# EAGLE schematic morse_lora (EAGLE 9.6.2)
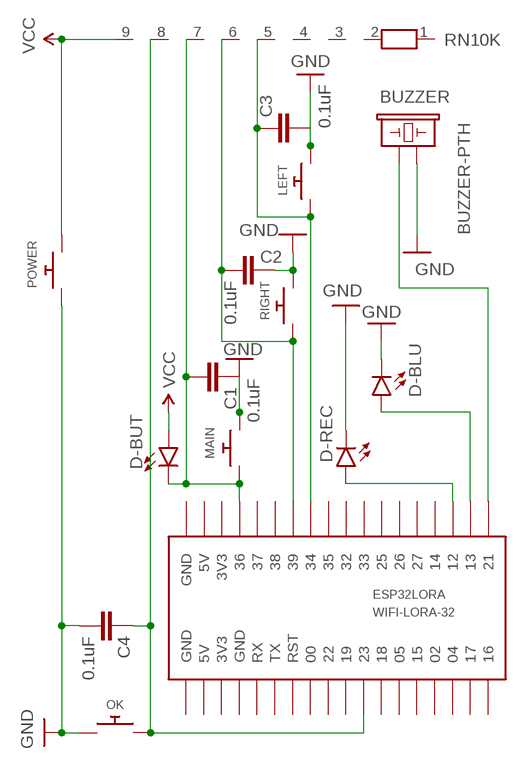
[diagram p0: schematic, sheet 1]

## Parts
BUZZER  BUZZER-PTH  [BUZZER-12MM]
C1  0.1uF  0.1UF-KIT-EZ-50V-20%  [CAP-PTH-SMALL-KIT]
C2  0.1uF  0.1UF-KIT-EZ-50V-20%  [CAP-PTH-SMALL-KIT]
C3  0.1uF  0.1UF-KIT-EZ-50V-20%  [CAP-PTH-SMALL-KIT]
C4  0.1uF  0.1UF-KIT-EZ-50V-20%  [CAP-PTH-SMALL-KIT]
D-BLU  LED5MM  [LED_5MM]
D-BUT  LED5MM  [LED_5MM]
D-REC  LED5MM  [LED_5MM]
ESP32LORA  WIFI-LORA-32  [2.54MM_2X18]
LEFT  SWITCH_PUSHBUTTONEVQ-PE  [TACT_PANA-EVQ]
MAIN  SWITCH_PUSHBUTTONEVQ-PE  [TACT_PANA-EVQ]
OK  SWITCH_PUSHBUTTONEVQ-PE  [TACT_PANA-EVQ]
POWER  SWITCH_PUSHBUTTONEVQ-PE  [TACT_PANA-EVQ]
RIGHT  SWITCH_PUSHBUTTONEVQ-PE  [TACT_PANA-EVQ]
RN10K  RN08  [RN-9]

## Nets
GND: BUZZER.- C1.1 C2.1 C3.2 C4.2 D-BLU.K(C) D-REC.K(C) LEFT.P$2 MAIN.P$2 OK.P$1 POWER.P$1 RIGHT.P$2
N$1: C1.2 D-BUT.K(C) ESP32LORA.P$33 MAIN.P$1 RN10K.7
N$2: C2.2 ESP32LORA.P$30 RIGHT.P$1 RN10K.6
N$3: C3.1 ESP32LORA.P$29 LEFT.P$1 RN10K.5
N$4: BUZZER.+ ESP32LORA.P$19
N$5: D-REC.A ESP32LORA.P$21
N$6: D-BLU.A ESP32LORA.P$20
N$7: C4.1 ESP32LORA.P$11 OK.P$2 RN10K.8
VCC: D-BUT.A POWER.P$2 RN10K.9
Unconnected: ESP32LORA.P$1(GND) ESP32LORA.P$2(5V) ESP32LORA.P$3(3V3) ESP32LORA.P$4(GND) ESP32LORA.P$5(RX) ESP32LORA.P$6(TX) ESP32LORA.P$7(RST) ESP32LORA.P$8 ESP32LORA.P$9 ESP32LORA.P$10 ESP32LORA.P$12 ESP32LORA.P$13 ESP32LORA.P$14 ESP32LORA.P$15 ESP32LORA.P$16 ESP32LORA.P$17 ESP32LORA.P$18 ESP32LORA.P$22 ESP32LORA.P$23 ESP32LORA.P$24 ESP32LORA.P$25 ESP32LORA.P$26 ESP32LORA.P$27 ESP32LORA.P$28 ESP32LORA.P$31 ESP32LORA.P$32 ESP32LORA.P$34(3V3) ESP32LORA.P$35(5V) ESP32LORA.P$36(GND) RN10K.1 RN10K.2 RN10K.3 RN10K.4

## Library data of the parts
BUZZER = SparkFun-Electromechanical:BUZZER: Buzzer Small round buzzers that operate around the audible 2kHz range. You can use these as speakers to create simple music or user interfaces. Variant Overview: PTH - Mini Speaker - PC Mount 12mm 2.048kHz <https://www.sparkfun.com/products/7950> PTH_KIT - Mini Speaker - PC Mount 12mm 2.048kHz <https://www.sparkfun.com/products/7950> KIT simplifies soldering by adding stop mask to one side of the pads. PTH_NO_SILK - Mini Speaker - PC Mount 12mm 2.048kHz <https://www.sparkfun.com/products/7950> No silkscreen indicator of buzzer outline. PTH_KIT_NO_SILK - Mini Speaker - PC Mount 12mm 2.048kHz <https://www.sparkfun.com/products/7950> KIT package w/o silkscreen SMD - Buzzer Audio Magnetic (CCV-084B16) SMD buzzer used on, e.g. the LilyPad Buzzer <https://www.sparkfun.com/products/8463> and RFID USB Reader <https://www.sparkfun.com/products/9963>. SMD_KIT - Buzzer Audio Magnetic (CCV-084B16) SMD Buzzer with elongated pins to make soldering easier. Used on the SparkFun Simon Says - Surface Mount Soldering Kit <https://www.sparkfun.com/products/10935>.; PROD_ID: COMP-08253; SF_SKU: COM-07950
C1-C4 = SparkFun-Capacitors:0.1UF: 0.1µF ceramic capacitors A capacitor is a passive two-terminal electrical component used to store electrical energy temporarily in an electric field.; PROD_ID: CAP-08370
D-BLU D-BUT D-REC = SparkFun-LED:LED: LED (Generic) Standard schematic elements and footprints for 5mm, 3mm, 1206, and 0603 sized LEDs. Generic LEDs with no color specified.
ESP32LORA = ESP32_modules:WIFI-LORA-32
LEFT MAIN OK POWER RIGHT = adafruit:SWITCH_PUSHBUTTON: Buttons SOFTTOUCHSMD_SJ - Soft touch temporary push button (Super Junk Akihabara) Compatible with SKPMANE010 [Mouser: 688-SKPMAN] C&K_KSS = Digikey: KSS221GLFS
RN10K = resistor-net:RN08: RESISTOR NETWORK; OC_FARNELL: unknown; OC_NEWARK: unknown